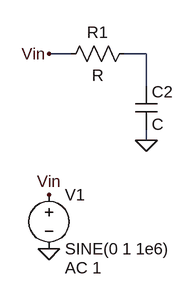
[diagram p0: schematic LPF.asc]
LPF.asc, the LTspice schematic file:
Version 4
SHEET 1 880 680
WIRE 32 128 0 128
WIRE 144 128 112 128
WIRE 144 176 144 128
WIRE 144 256 144 240
FLAG 144 256 0
FLAG 0 128 Vin
FLAG 0 336 Vin
FLAG 0 416 0
SYMBOL cap 128 176 R0
SYMATTR InstName C2
SYMBOL res 128 112 R90
WINDOW 0 0 56 VBottom 2
WINDOW 3 32 56 VTop 2
SYMATTR InstName R1
SYMBOL voltage 0 320 R0
WINDOW 123 24 124 Left 2
WINDOW 39 0 0 Left 0
SYMATTR InstName V1
SYMATTR Value SINE(0 1 1e6)
SYMATTR Value2 AC 1

The netlist it stands for:
* LPF.asc
C2 N001 0 C
R1 N001 Vin R
V1 Vin 0 SINE(0 1 1e6) AC 1
.backanno
.end